# Altium schematic sheet P_A19_SmartPlugV3.SchDoc
size A2
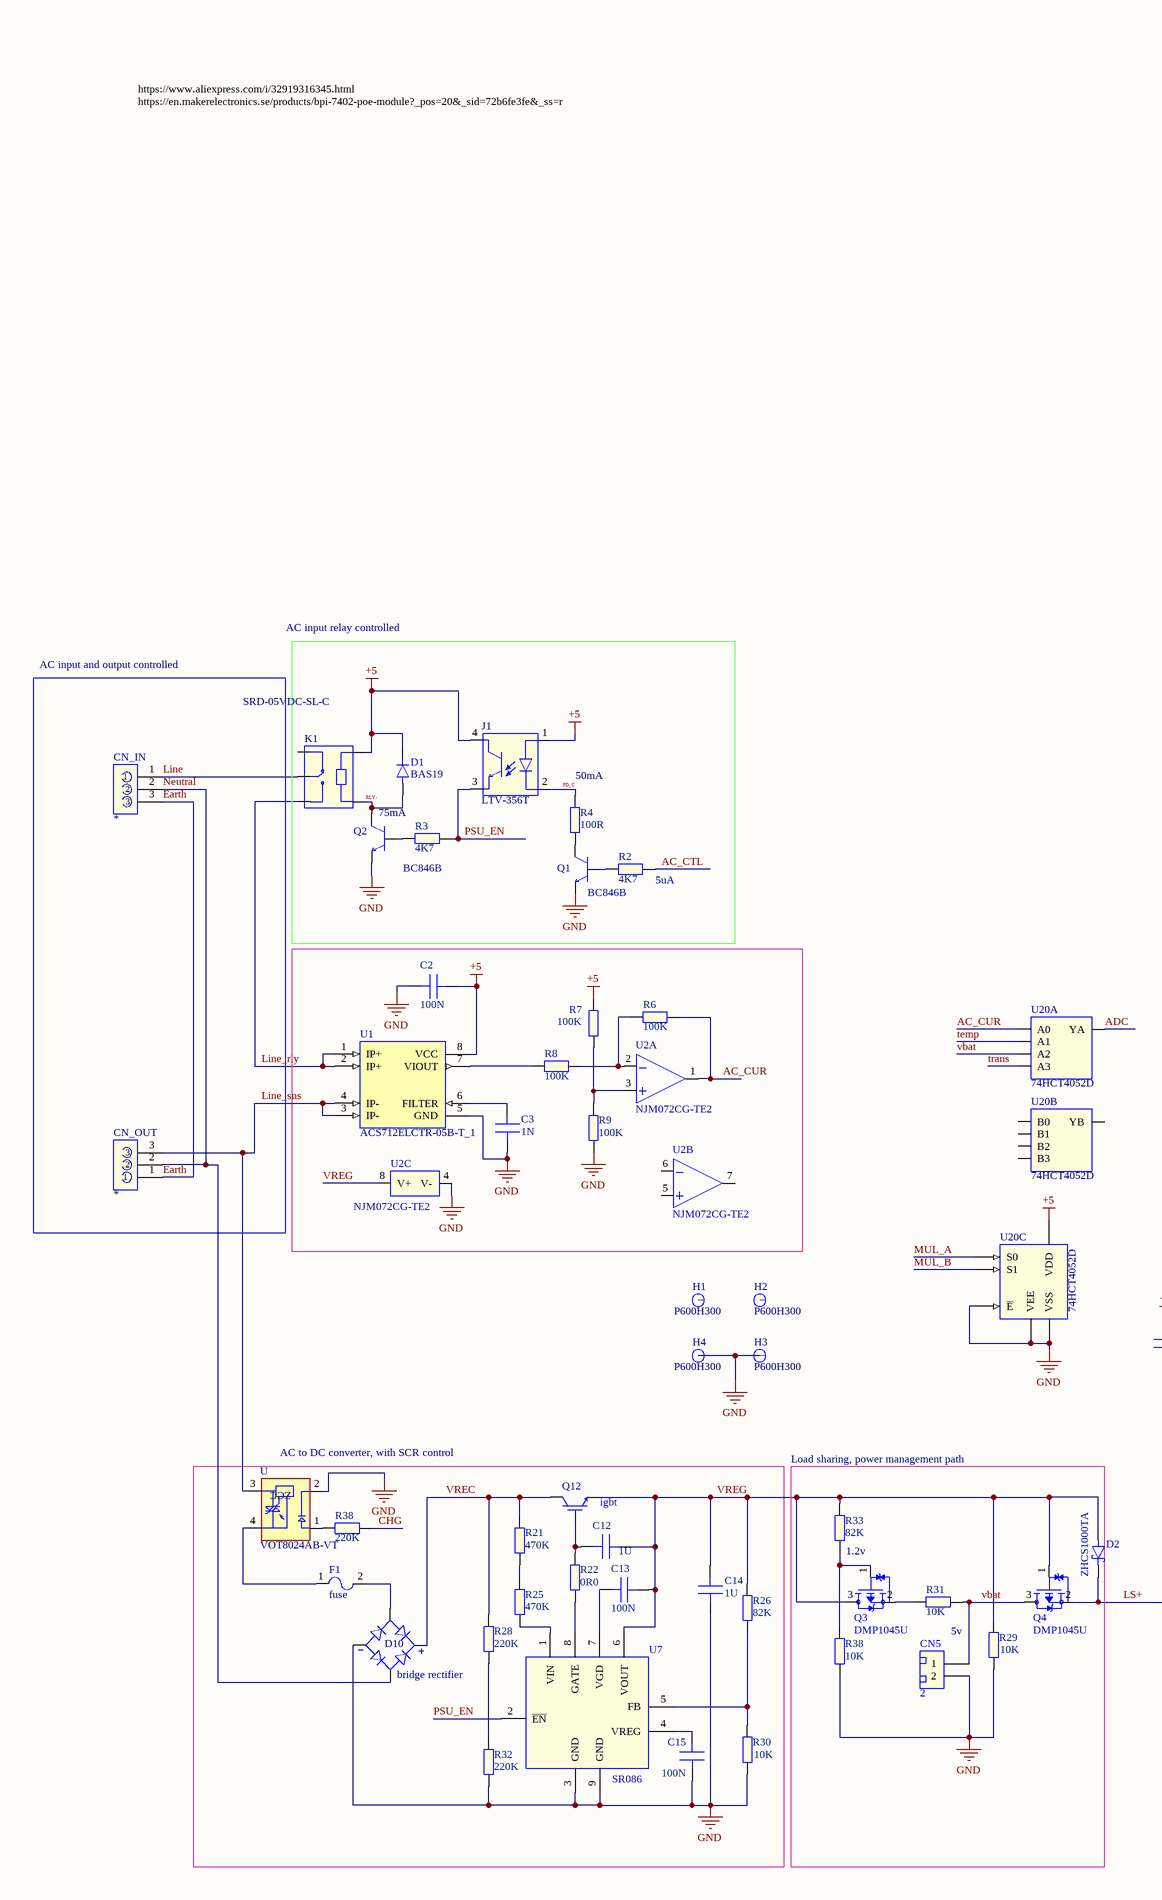
[diagram p0: P_A19_SmartPlugV3.SchDoc, left]
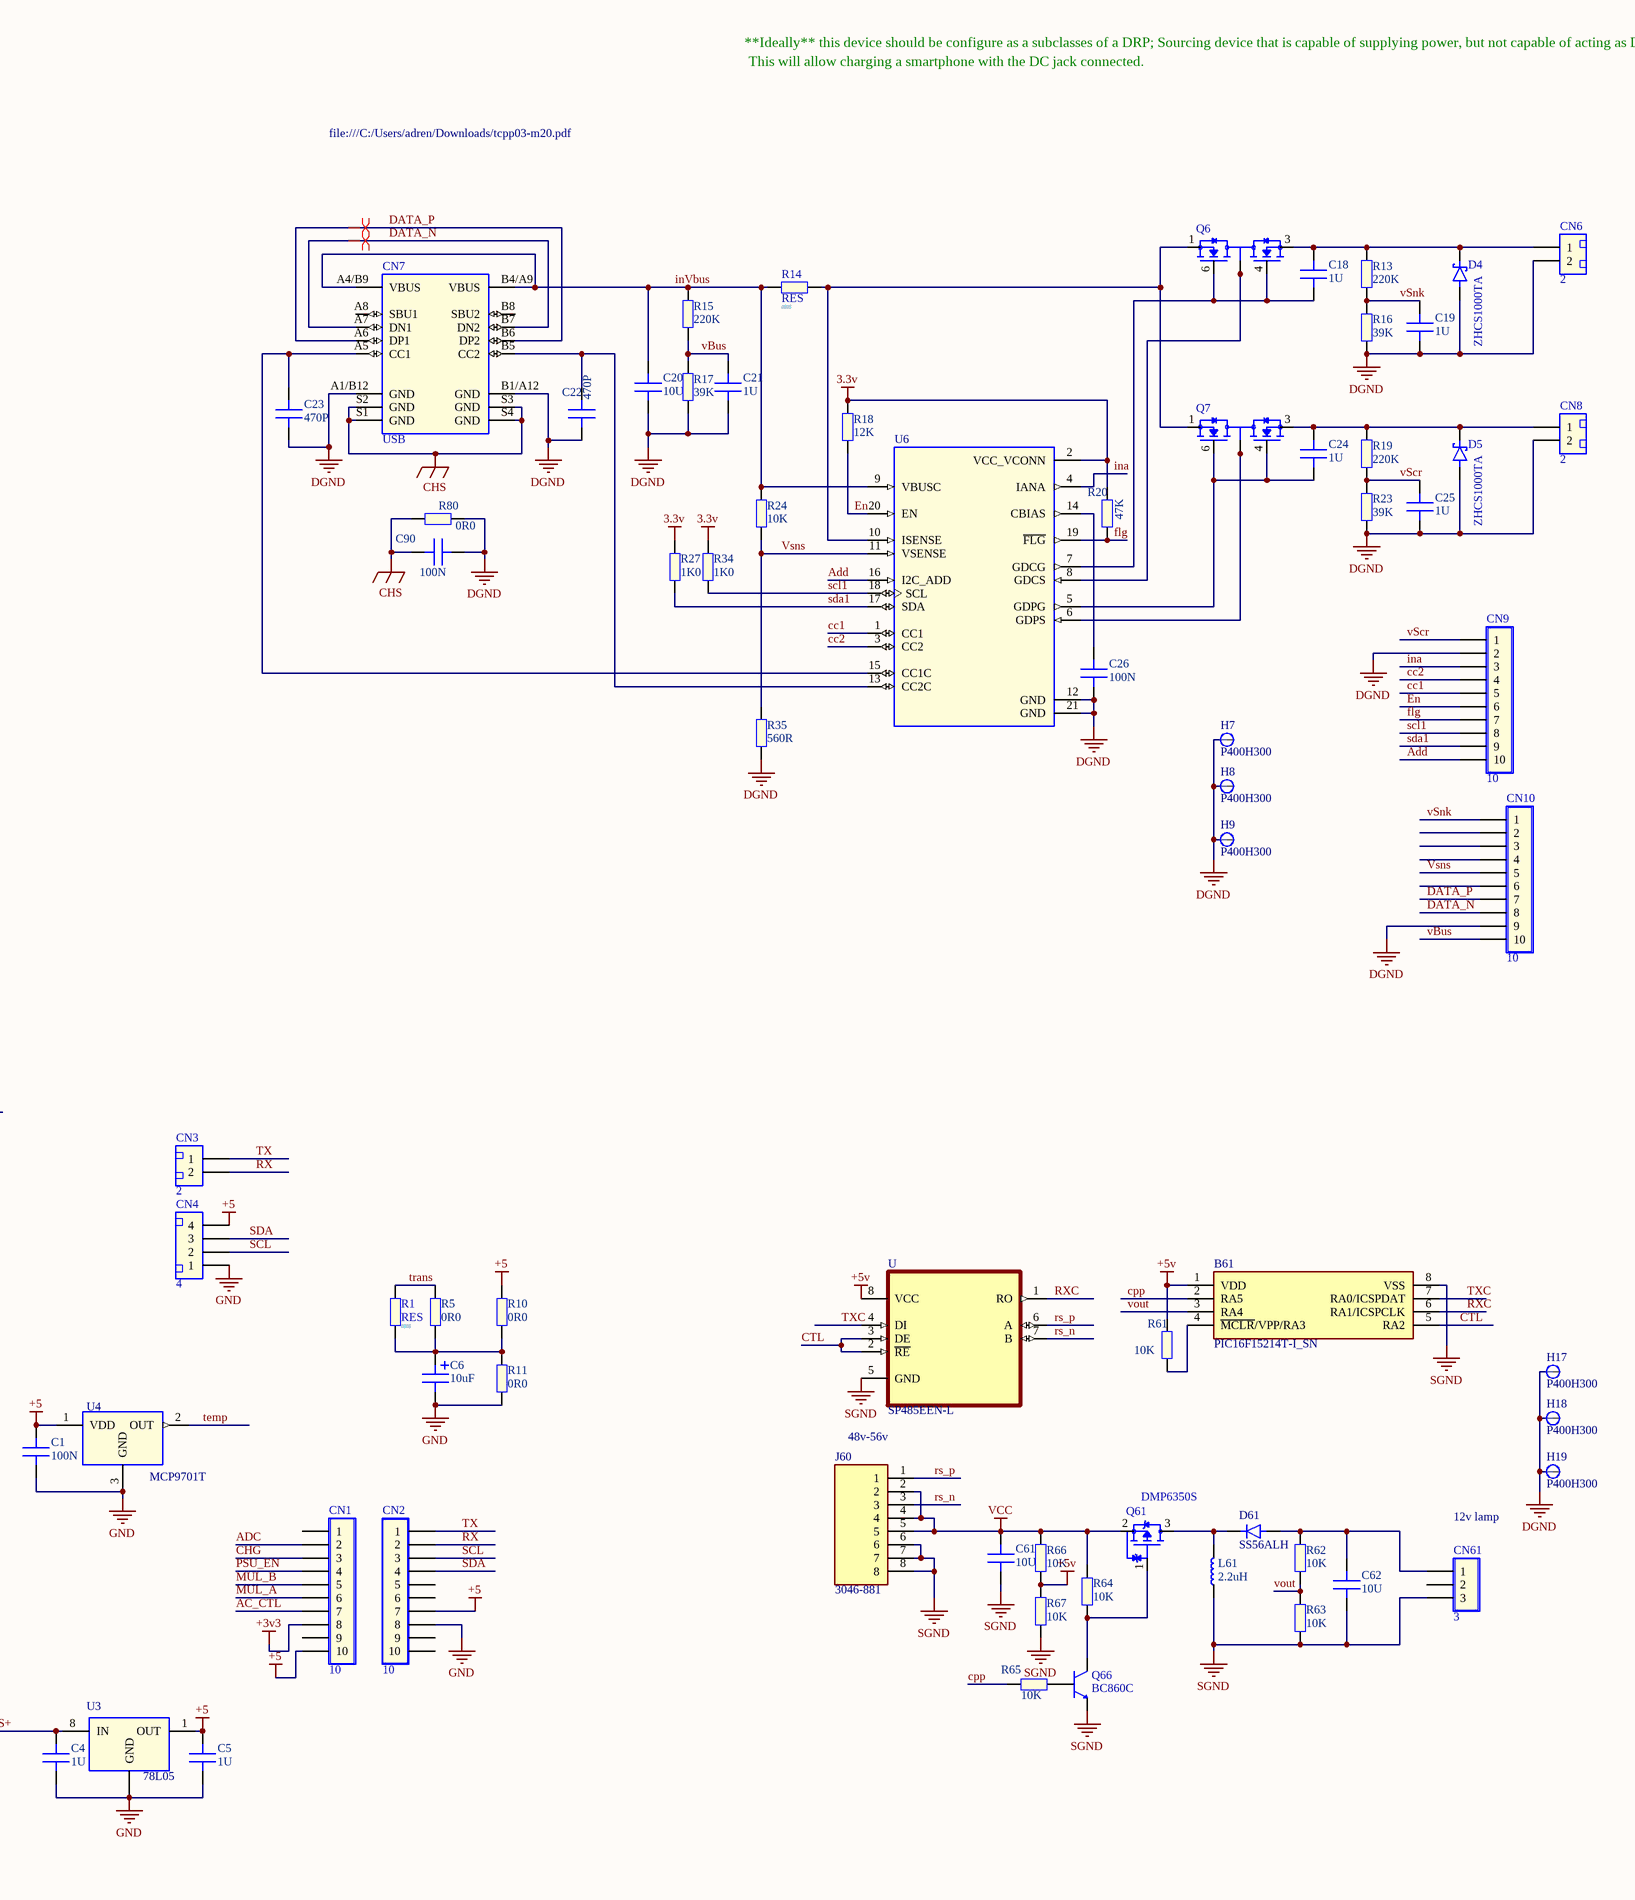
[diagram p1: P_A19_SmartPlugV3.SchDoc, right]

## Parts
(Parts that share a designator on the sheet are numbered #1, #2 ... from top to bottom, then left to right.)
B61  PIC16F15214T-I_SN  [SOIC127P600X175-8N]
C1  100N  [CAPC2012X60N]
C2  100N  [CAPC2012X60N]
C3  1N  [CAPC2012X60N]
C4  1U  [CAPC2012X60N]
C5  1U  [CAPC2012X60N]
C6  10uF  [CAPAE430X540]
C12  1U  [CAPC2012X60N]
C13  100N  [CAPC2012X60N]
C14  1U  [CAPC2012X60N]
C15  100N  [CAPC2012X60N]
C18  1U  [CAPC2012X60N]
C19  1U  [CAPC2012X60N]
C20  10U  [CAPC2012X60N]
C21  1U  [CAPC2012X60N]
C22  470P  [CAPC2012X60N]
C23  470P  [CAPC2012X60N]
C24  1U  [CAPC2012X60N]
C25  1U  [CAPC2012X60N]
C26  100N  [CAPC2012X60N]
C61  10U  [CAPC2012X60N]
C62  10U  [CAPC2012X60N]
C90  100N  [CAPC2012X60N]
CN1  10  [THT_Hdr_Fm_10x1_0.1_ST]
CN2  10  [THT_Hdr_Fm_10x1_0.1_ST]
CN3  2  [THT_Hdr_JST_XH_Fm_2x1_0.1_RA]
CN4  4  [THT_Hdr_JST_XH_Fm_4x1_0.1_RA]
CN5  2  [THT_Hdr_JST_XH_Fm_2x1_0.1_RA]
CN6  2  [THT_Hdr_JST_XH_Fm_2x1_0.1_RA]
CN7  USB  [GCT_USB4110-GF-A_REVB]
CN8  2  [THT_Hdr_JST_XH_Fm_2x1_0.1_RA]
CN9  10  [THT_Hdr_Fm_10x1_0.1_ST]
CN10  10  [THT_Hdr_Fm_10x1_0.1_ST]
CN61  3  [THT_Hdr_Fm_3x1_0.1_ST]
CN_IN  screwterminal  [TE_282841-3]  (value not drawn)
CN_OUT  screwterminal  [TE_282841-3]  (value not drawn)
D1  BAS19  [SOT95P230X110-3N]
D2  ZHCS1000TA  [SOT95P230X110-3N]
D4  ZHCS1000TA  [SOT95P230X110-3N]
D5  ZHCS1000TA  [SOT95P230X110-3N]
D10  bridge rectifier  [SOIC254P670X180-4N]
D61  SS56ALH  [SODFL5226X100N]
F1  fuse  [FUSC1608X60N]
H1  P600H300  [P600H300]
H2  P600H300  [P600H300]
H3  P600H300  [P600H300]
H4  P600H300  [P600H300]
H7  P400H300  [P400H300]
H8  P400H300  [P400H300]
H9  P400H300  [P400H300]
H17  P400H300  [P400H300]
H18  P400H300  [P400H300]
H19  P400H300  [P400H300]
J1  LTV-356T  [SOIC254P670X180-4N]
J60  3046-881  [VALCON_3046-881]
K1  SRD-05VDC-SL-C  [RELAY_SRD-05VDC-SL-C]  (mechanical)
L61  2.2uH  [INDC1811X91N]
Q1  BC846B  [SOT95P230X110_BEC-3N]
Q2  BC846B  [SOT95P230X110_BEC-3N]
Q3  DMP1045U  [SOT91P240X110-3N]
Q4  DMP1045U  [SOT91P240X110-3N]
Q6  (no value)  [SOT95P280X145-6N]
Q7  (no value)  [SOT95P280X145-6N]
Q12  igbt  [TO460P1010X230-3N]
Q61  DMP6350S  [SOT91P240X110-3N]
Q66  BC860C  [SOT95P230X110_BEC-3N]
R1  RES  Footprint: 0805  [RESADV350W55L740D260B]
R2  4K7  [RESC2012X60N]
R3  4K7  [RESC2012X60N]
R4  100R  [RESC2012X60N]
R5  0R0  [RESC2012X60N]
R6  100K  [RESC2012X60N]
R7  100K  [RESC2012X60N]
R8  100K  [RESC2012X60N]
R9  100K  [RESC2012X60N]
R10  0R0  [RESC2012X60N]
R11  0R0  [RESC2012X60N]
R13  220K  [RESC2012X60N]
R14  RES  Footprint: 0805  [RESADV350W55L740D260B]
R15  220K  [RESC2012X60N]
R16  39K  [RESC2012X60N]
R17  39K  [RESC2012X60N]
R18  12K  [RESC2012X60N]
R19  220K  [RESC2012X60N]
R20  47K  [RESC2012X60N]
R21  470K  [RESC2012X60N]
R22  0R0  [RESC2012X60N]
R23  39K  [RESC2012X60N]
R24  10K  [RESC2012X60N]
R25  470K  [RESC2012X60N]
R26  82K  [RESC2012X60N]
R27  1K0  [RESC2012X60N]
R28  220K  [RESC2012X60N]
R29  10K  [RESC2012X60N]
R30  10K  [RESC2012X60N]
R31  10K  [RESC2012X60N]
R32  220K  [RESC2012X60N]
R33  82K  [RESC2012X60N]
R34  1K0  [RESC2012X60N]
R35  560R  [RESC2012X60N]
R38#1  220K  [RESC2012X60N]
R38#2  10K  [RESC2012X60N]
R61  10K  [RESC2012X60N]
R62  10K  [RESC2012X60N]
R63  10K  [RESC2012X60N]
R64  10K  [RESC2012X60N]
R65  10K  [RESC2012X60N]
R66  10K  [RESC2012X60N]
R67  10K  [RESC2012X60N]
R80  0R0  [RESC2012X60N]
U1  ACS712ELCTR-05B-T_1  [SOIC127P600X175-8N]
U2  NJM072CG-TE2  [SOIC127P600X175-8N]  (parts A,B,C of 3)
U3  78L05  [SOIC127P600X175-8N]
U4  MCP9701T  [SOT95P230X110-3N]
U6  (no value)  [QFN50P400X400X80-21N]
U7  SR086  [SOIC127P600X175-9N]
U20  74HCT4052D  [SOIC127P600X175-16N]  (parts A,B,C of 3)
U#1  SP485EEN-L  [SOIC127P600X175-8N]
U#2  VOT8024AB-VT  [SOIC254P1016X440-4N]

## Blocks framed on the sheet
AC input and output controlled: CN_IN CN_OUT
AC to DC converter, with SCR control: C12-C15 D10 F1 Q12 R21 R22 R25 R26 R28 R30 R32 R38#1 U7 U#2

## Nets
3.3v: R18.2 R20.2 R27.2 R34.2 U6.2(VCC_VCONN)
+3v3: CN1.8
+5: C1.2 C2.2 C5.2 CN1.10 CN2.7 CN4.4 D1.3(K) J1.1(A) J1.4(COL) K1.A2 R7.2 R10.2 U1.8(VCC) U3.1(OUT) U4.1(VDD) U20.16(VDD)
+5v: B61.1(VDD) R61.2 R66.2 R67.1 U#1.8(VCC)
CHS: C90.1 CN7.S1(GND) CN7.S2(GND) CN7.S3(GND) CN7.S4(GND) R80.2
DGND: C19.1 C20.1 C21.1 C22.1 C23.1 C25.1 C26.1 C90.2 CN6.2 CN7.A1/B12(GND) CN7.B1/A12(GND) CN8.2 CN9.2 CN10.9 D4.3(A) D5.3(A) H7.1 H8.1 H9.1 H17.1 H18.1 H19.1 R16.1 R17.1 R23.1 R35.1 R80.1 U6.12(GND) U6.21(GND)
GND: C1.1 C2.1 C3.1 C4.1 C5.1 C6.2 C14.1 C15.1 CN2.8 CN4.1 CN5.2 D10.3(NEG) H3.1 H4.1 Q1.E Q2.E R9.2 R11.1 R29.1 R30.1 R32.1 R38#2.2 U1.5(GND) U2.4(V-) U3.2(GND) U3.3(GND) U3.6(GND) U3.7(GND) U4.3(GND) U7.3(GND) U7.9(GND) U20.6(~{E}) U20.7(VEE) U20.8(VSS) U#2.2(C)
SGND: B61.8(VSS) C61.1 C62.1 CN61.3 J60.6 J60.7 J60.8 L61.1 Q66.E R63.1 R67.2 U#1.5(GND)
VCC: C61.2 J60.2 J60.4 J60.5 Q61.2(S) R64.2 R66.1
AC_CTL: CN1.7 R2.2
AC_CUR: R6.1 U2.1(OUTPUT) U20.12(A0)
ADC: CN1.2 U20.13(YA)
Add: CN9.10 U6.16(I2C_ADD)
cc1: CN9.5 U6.1(CC1)
cc2: CN9.4 U6.3(CC2)
CHG: CN1.3 R38#1.1
cpp: B61.2(RA5) R65.2
CTL: B61.5(RA2) U#1.2(~{RE}) U#1.3(DE)
DATA_N: CN7.A7(DN1) CN7.B7(DN2) CN10.8
DATA_P: CN7.A6(DP1) CN7.B6(DP2) CN10.7
Earth: CN_IN.3 CN_OUT.1
En: CN9.6 R18.1 U6.20(EN)
flg: CN9.7 R20.1 U6.19(~{FLG})
ina: CN9.3 U6.4(IANA)
inVbus: C20.2 CN7.A4/B9(VBUS) CN7.B4/A9(VBUS) R14.1 R15.2 R24.2 U6.9(VBUSC)
Line: CN_IN.1 K1.COM
Line_rly: K1.NO U1.1(IP+) U1.2(IP+)
Line_sns: CN_OUT.3 U1.3(IP-) U1.4(IP-) U#2.3(MT1)
LS+: C4.2 D2.1(K) Q4.2(S) U3.8(IN)
MUL_A: CN1.6 U20.10(S0)
MUL_B: CN1.5 U20.9(S1)
Neutral: CN_IN.2 CN_OUT.2 D10.2(AC1)
PD_C: J1.2(C) R4.2
PSU_EN: CN1.4 J1.3(EMIT) R3.2 U7.2(~{EN})
RLY-: D1.1(A) K1.A1 Q2.C
rs_n: J60.3 U#1.7(B)
rs_p: J60.1 U#1.6(A)
RX: CN2.2 CN3.2
RXC: B61.6(RA1/ICSPCLK) U#1.1(RO)
SCL: CN2.3 CN4.2
scl1: CN9.8 R34.1 U6.18(SCL)
SDA: CN2.4 CN4.3
sda1: CN9.9 R27.1 U6.17(SDA)
temp: U4.2(OUT) U20.14(A1)
trans: R1.2 R5.2 U20.11(A3)
TX: CN2.1 CN3.1
TXC: B61.7(RA0/ICSPDAT) U#1.4(DI)
vbat: CN5.1 Q4.3(D) R31.1 U20.15(A2)
vBus: C21.2 CN10.10 R15.1 R17.2
vout: B61.3(RA4) R62.1 R63.2
VREC: D10.1(POS) Q12.2(C) R21.2 R28.2
VREG: C12.2 C13.2 C14.2 D2.3(A) Q3.3(D) Q4.1(G) Q12.3(E) R26.2 R29.2 R33.2 U2.8(V+) U7.6(VOUT)
vScr: C25.2 CN9.1 R19.1 R23.2
vSnk: C19.2 CN10.1 R13.1 R16.2
Vsns: CN10.5 R24.1 R35.2 U6.11(VSENSE)
NetB61_4: B61.4(~{MCLR}/VPP/RA3) R61.1
NetC3_2: C3.2 U1.6(FILTER)
NetC6_1: C6.1 R1.1 R5.1 R10.1 R11.2
NetC12_1: C12.1 Q12.1(G) R22.2
NetC13_1: C13.1 U7.7(VGD)
NetC15_2: C15.2 U7.4(VREG)
NetC18_1: C18.1 Q6.4(G2) Q6.6(G1) U6.7(GDCG)
NetC18_2: C18.2 CN6.1 D4.1(K) Q6.3(S2) R13.2
NetC22_2: C22.2 CN7.B5(CC2) U6.13(CC2C)
NetC23_2: C23.2 CN7.A5(CC1) U6.15(CC1C)
NetC24_1: C24.1 Q7.4(G2) Q7.6(G1) U6.5(GDPG)
NetC24_2: C24.2 CN8.1 D5.1(K) Q7.3(S2) R19.2
NetC26_2: C26.2 U6.14(CBIAS)
NetC62_2: C62.2 CN61.1 D61.2(A) R62.2
NetD10_4: D10.4(AC2) F1.2
NetD61_1: D61.1(K) L61.2 Q61.3(D)
NetF1_1: F1.1 U#2.4(MT2)
NetQ1_B: Q1.B R2.1
NetQ1_C: Q1.C R4.1
NetQ2_B: Q2.B R3.1
NetQ3_1: Q3.1(G) R33.1 R38#2.1
NetQ3_2: Q3.2(S) R31.2
NetQ6_1: Q6.1(S1) Q7.1(S1) R14.2 U6.10(ISENSE)
NetQ6_2: Q6.2(D12) Q6.5(D12) U6.8(GDCS)
NetQ7_2: Q7.2(D12) Q7.5(D12) U6.6(GDPS)
NetQ61_1: Q61.1(G) Q66.C R64.1
NetQ66_B: Q66.B R65.1
NetR6_2: R6.2 R8.1 U2.2(INV)
NetR7_1: R7.1 R9.1 U2.3(NONINV)
NetR8_2: R8.2 U1.7(VIOUT)
NetR21_1: R21.1 R25.2
NetR22_1: R22.1 U7.8(GATE)
NetR25_1: R25.1 U7.1(VIN)
NetR26_1: R26.1 R30.2 U7.5(FB)
NetR28_1: R28.1 R32.2
NetR38#1_2: R38#1.2 U#2.1(A)

Not connected (* = marked no-connect by the designer): CN1 1 9; CN2 5 6 9 10; CN7 A8(SBU1) B8(SBU2); CN10 2 3 4 6; CN61 2; H1 1; H2 1; K1 NC; U2 5(NONINV) 6(INV) 7(OUTPUT); U20 1(B0) 2(B2) 3(YB) 4(B3) 5(B1)

## Layout directives
differential pair: DATA_N, DATA_P

## Notes on the sheet
- **Ideally** this device should be configure as a subclasses of a DRP; Sourcing device that is capable of supplying power, but not capable of acting as DFP
- This will allow charging a smartphone with the DC jack connected.
- file:///C:/Users/adren/Downloads/tcpp03-m20.pdf
- https://www.aliexpress.com/i/32919316345.html
  https://en.makerelectronics.se/products/bpi-7402-poe-module?_pos=20&_sid=72b6fe3fe&_ss=r
- AC input relay controlled
- 50mA
- (near Q2) 75mA
- (near R2) 5uA
- 48v-56v
- Load sharing, power management path
- 12v lamp
- (near R33) 1.2v
- 5v
- (in symbol VOT8024AB-VT) ZCC

## Library data of the parts
B61 = PIC16F15214T-I_SN: PIC16F15214T-I/SN; Manufacturer_Name: Microchip; Geometry.Height: 1.75mm; Manufacturer_Part_Number: PIC16F15214T-I/SN; Mouser Part Number: 579-PIC16F15214TI/SN; Mouser Price/Stock: https://www.mouser.co.uk/ProductDetail/Microchip-Technology/PIC16F15214T-I-SN?qs=xZ%2FP%252Ba9zWqa0z7iit6vIGQ%3D%3D; Arrow Part Number: PIC16F15214T-I/SN; Arrow Price/Stock: https://www.arrow.com/en/products/pic16f15214t-isn/microchip-technology?region=nac; Datasheet Link: https://ww1.microchip.com/downloads/en/DeviceDoc/PIC16F15213-14-23-24-43-44-Data-Sheet-DS40002195B.pdf
C1 C2 C26 C90 = 118: 100N 0805 X7R 5% 50V SMD Ceramic capacitor; UA P/N: 16-0001; LibraryVersion: v1; Value: 100N; Farnell: 2408561; My_PN: *; Mounting: SMT; Unique ID: 118; Cost: 0.0195; Category: [0000] Passive components; Subcategory: [0002] Capacitor
C3 = 122: 1N 0805 COG 100V SMD Ceramic capacitor; UA P/N: 16-0008; LibraryVersion: v1; Value: 1N; Farnell: 718567RL; My_PN: *; Mounting: SMT; Unique ID: 122; Cost: 0.0123; Category: [0000] Passive components; Subcategory: [0002] Capacitor
C4 C5 C12 C14 C18 C19 C21 C24 C25 = 138: 1U 0805 50V X7R SMD Ceramic capacitor; UA P/N: 16-0010; LibraryVersion: v1; Value: 1U; Farnell: 3366605; My_PN: *; Mounting: SMT; Unique ID: 138; Cost: 0.0199; Category: [0000] Passive components; Subcategory: [0002] Capacitor
C6 = 141: 10uF 16V Multicomp SMD Electrolytic; UA P/N: 16-0026; LibraryVersion: v1; Value: 10uF; Farnell: 9265686; My_PN: *; Mounting: SMT; Unique ID: 141; Cost: 0.0533; Category: [0000] Passive components; Subcategory: [0003] Capacitor electrolytic
C13 C15 = 135: 100N 1206 COG 50V SMD Ceramic capacitor; UA P/N: 16-0021; LibraryVersion: v1; Value: 100N; Farnell: 2211074RL; My_PN: *; Mounting: SMT; Unique ID: 135; Cost: 0.122; Category: [0000] Passive components; Subcategory: [0002] Capacitor
C20 = 139: 10U 0805  X6S 35V SMD Ceramic capacitor; UA P/N: 16-0004; LibraryVersion: v1; Value: 10U; Farnell: 3581774; My_PN: *; Mounting: SMT; Unique ID: 139; Cost: 0.172; Category: [0000] Passive components; Subcategory: [0002] Capacitor
C22 C23 = 119: 470P 0805 X7R 10% 50V Ceramic Capacitor; UA P/N: 16-0018; LibraryVersion: v1; Value: 470P; Farnell: 1759216; My_PN: *; Mounting: SMT; Unique ID: 119; Cost: 0.0108; Category: [0000] Passive components; Subcategory: [0002] Capacitor
C61 C62 = 166: 10U 0805  X5R 25V SMD Ceramic capacitor; UA P/N: 16-0049; LibraryVersion: v1; Value: 10U; Farnell: 3366590; My_PN: *; Mounting: SMT; Unique ID: 166; Cost: 0.172; Category: [0000] Passive components; Subcategory: [0002] Capacitor
CN1 CN2 CN9 CN10 = 377: 10 WAY FM SOCKET; UA P/N: 112-0102; LibraryVersion: V1; Farnell: V06-1x10-SV-GF-1; ComponentLink1Description: Web MF; ComponentLink1URL: https://www.jst.co.uk/; ComponentLink2Description: Datasheet web; ComponentLink2URL: https://www.jst-mfg.com; ComponentLink3Description: Datasheet local; ComponentLink3URL: /D/; Value: 10; Unique ID: 377; Cost: 0.0712; Category: [0500] Connectors; Subcategory: [0503] Headers; Mounting: THT
CN3 CN5 CN6 CN8 = 535: 2 PIN SIL JST 2.54mm straight angle; LibraryVersion: V1; ComponentLink1Description: Web MF; ComponentLink1URL: https://www.jst.co.uk/; ComponentLink2Description: Datasheet web; ComponentLink2URL: https://www.jst-mfg.com; ComponentLink3Description: Datasheet local; ComponentLink3URL: /D/; Value: 2; Unique ID: 535; Cost: 0; Category: [0500] Connectors; Subcategory: [0507] Header JST XH; Mounting: THT
CN4 = 533: 4 PIN SIL JST 2.54mm straight angle; LibraryVersion: V1; ComponentLink1Description: Web MF; ComponentLink1URL: https://www.jst.co.uk/; ComponentLink2Description: Datasheet web; ComponentLink2URL: https://www.jst-mfg.com; ComponentLink3Description: Datasheet local; ComponentLink3URL: /D/; Value: 4; Unique ID: 533; Cost: 0; Category: [0500] Connectors; Subcategory: [0507] Header JST XH; Mounting: THT
CN7 = 399: USB C CONNECTOR SMD; UA P/N: 112-0099; LibraryVersion: V1; Farnell: 3588206; Value: USB; ComponentLink1Description: Web MF; ComponentLink1URL: https://gct.co; ComponentLink2Description: Datasheet web; ComponentLink2URL: https://pdf1.alldatasheet.com/datasheet-pdf/view/1355856/ETC/USB4110-GF-A.html; ComponentLink3Description: Datasheet local; ComponentLink3URL: /D/; Unique ID: 399; Cost: 0.662; Category: [0500] Connectors; Subcategory: [0502] USB connectors; Mounting: SMD
CN61 = 536: 3 PIN SIL 0.1"; LibraryVersion: V1; ComponentLink1Description: Web MF; ComponentLink1URL: https://www.jst.co.uk/; ComponentLink2Description: Datasheet web; ComponentLink2URL: https://www.jst-mfg.com; ComponentLink3Description: Datasheet local; ComponentLink3URL: /D/; Value: 3; Unique ID: 536; Cost: 0; Category: [0500] Connectors; Subcategory: [0503] Headers; Mounting: THT
CN_IN CN_OUT = 523: LibraryVersion: V1; Price: None; Check_prices: https://www.snapeda.com/parts/282841-3/TE+Connectivity+AMP+Connectors/view-part/?ref=eda; Value: screwterminal; SnapEDA_Link: https://www.snapeda.com/parts/282841-3/TE+Connectivity+AMP+Connectors/view-part/?ref=snap; EU_RoHS_Compliance: Compliant with Exemptions; Availability: In Stock; Purchase-URL: https://pricing.snapeda.com/search?q=282841-3&ref=eda; Comment_1: *; Unique ID: 523; Cost: 0; Category: [0500] Connectors; Subcategory: [0509] ScrewTerminal; Mounting: THT
D1 = 214: BAS19 SMD Signal Diode Alternative 15-0007; UA P/N: 15-0081; LibraryVersion: v1; Farnell: 2319273; Value: BAS19; ComponentLink1Description: Web MF; ComponentLink1URL: https://www.nexperia.com; ComponentLink2Description: Datasheet web; ComponentLink2URL: https://www.nexperia.com/products/diodes/automotive-diodes/automotive-switching-diodes/automotive-general-purpose-switching-diodes/BAS19.html; ComponentLink3Description: Datasheet local; ComponentLink3URL: /D/; Unique ID: 214; Cost: 0.0116; Category: [0300] Discrete Semiconductors; Subcategory: [0304] Diodes; Mounting: SMT
D2 D4 D5 = 219: ZHCS1000TA Schottky Rectifier, 40V 1A 425 mV; UA P/N: 15-0119; LibraryVersion: v1; Farnell: 9526773; Value: ZHCS1000TA; ComponentLink1Description: Web MF; ComponentLink1URL: https://www.diodes.com; ComponentLink2Description: Datasheet web; ComponentLink2URL: https://pdf1.alldatasheet.com/datasheet-pdf/view/515456/DIODES/ZHCS1000TA.html; ComponentLink3Description: Datasheet local; ComponentLink3URL: /D/; Unique ID: 219; Cost: 0.157; Category: [0300] Discrete Semiconductors; Subcategory: [0308] Schottky Diodes; Mounting: SMT
D10 = 521: LibraryVersion: V1; Check_prices: https://www.snapeda.com/parts/MB10F-13/Diodes+Inc./view-part/?ref=eda; Value: bridge rectifier; Availability: In Stock; Price: None; SnapEDA_Link: https://www.snapeda.com/parts/MB10F-13/Diodes+Inc./view-part/?ref=snap; Purchase-URL: https://pricing.snapeda.com/search/part/MB10F-13/?ref=eda; Unique ID: 521; Cost: 0; Category: [0300] Discrete Semiconductors; Subcategory: [0306}BridgeRectifiers; Mounting: SMT
D61 = SS56ALH: 5A, 60V, Schottky Rectifier; MF: Taiwan Semiconductor; Package: DO-221AC Taiwan Semiconductor; Availability: In Stock; Value: *; MP: SS56ALH; Check_prices: https://www.snapeda.com/parts/SS56ALH/Taiwan+Semiconductor/view-part/?ref=eda; Price: None; SnapEDA_Link: https://www.snapeda.com/parts/SS56ALH/Taiwan+Semiconductor/view-part/?ref=snap
F1 = 524: LibraryVersion: V1; Mouser-Purchase-URL: https://snapeda.com/shop?store=Mouser&id=4616119; SnapEDA_Link: https://www.snapeda.com/parts/0686F1000-01/Bel%20Fuse/view-part/4616119/?ref=snap; Price: None; Availability: Unavailable; Value: fuse; Unique ID: 524; Cost: 0; Category: [0700] Circuit Protection; Subcategory: [0702]Fuse; Mounting: SMT
H1-H4 = 505: [1001]HOLE_PLATED_P600H300; Value: P600H300; Unique ID: 505; Category: [1000] Machining; Subcategory: [1001] Holes
H7-H9 H17-H19 = 506: [1001]HOLE_PLATED_P400H300; Value: P400H300; Unique ID: 506; Category: [1000] Machining; Subcategory: [1001] Holes
J1 = 531: LibraryVersion: V1; Value: LTV-356T; Check_prices: https://www.snapeda.com/parts/LTV-356T/Lite-On+Inc./view-part/?ref=eda; SnapEDA_Link: https://www.snapeda.com/parts/LTV-356T/Lite-On+Inc./view-part/?ref=snap; Availability: In Stock; Purchase-URL: https://pricing.snapeda.com/search/part/LTV-356T/?ref=eda; Price: None; Unique ID: 531; Cost: 0; Category: [0400] Optoelectronics; Subcategory: [0402]Optocouplers; Mounting: SMT
J60 = 3046-881: Value: C708627; Price: None; Availability: Unavailable; MP: 3046-881; Package: None
K1 = RELAY_SPDT_TEMPLATE: 5V Trigger Relay Module For Arduino And Raspberry Pi 5V Trigger Relay Module For Arduino And Raspberry Pi; MF: Songle Relay; Check_prices: https://www.snapeda.com/parts/SRD-05VDC-SL-C/Songle+Relay/view-part/?ref=eda; Value: SRD-05VDC-SL-C; Availability: Not in stock; Price: None; Package: NON STANDARD-5 Songle Relay; MP: SRD-05VDC-SL-C; SnapEDA_Link: https://www.snapeda.com/parts/SRD-05VDC-SL-C/Songle+Relay/view-part/?ref=snap; LCSC: C140615
L61 = 503: 2.2uH inductor; UA P/N: 113-0031; LibraryVersion: V1; Value: 2.2uH; Farnell: 2288737; My_PN: *; Mounting: SMT; Unique ID: 503; Cost: 0.422; Category: [0000] Passive components; Subcategory: [0005] Inductor
Q1 Q2 = 268: BC846B NPN General Purpose Transistor; UA P/N: 15-0008; LibraryVersion: v1; Farnell: 2319373; Value: BC846B; ComponentLink1Description: Web MF; ComponentLink1URL: https://www.nexperia.com; ComponentLink2Description: Datasheet web; ComponentLink2URL: https://pdf1.alldatasheet.com/datasheet-pdf/view/1577659/NEXPERIA/BC846A.html; ComponentLink3Description: Datasheet local; ComponentLink3URL: /D/; Unique ID: 268; Cost: 0.02652; Category: [0300] Discrete Semiconductors; Subcategory: [0301] BJTs; Mounting: SMT
Q3 Q4 = DMP1045U: P-Channel 12V 4A (Ta) 800mW (Ta) Surface Mount SOT-23; MP: FS8205A; UA P/N: 15-0xxx; Farnell: *; Mouser: *; RS: *; DigiKey: *; Arrow: *; Profusion: *; My_P/N: *; HelpURL: https://www.diodes.com/assets/Datasheets/DMP1045U.pdf; Package: SOT91P240X110-3N; Value: DMP1045U; ComponentLink1Description: Web MF; ComponentLink1URL: https://www.diodes.com; ComponentLink2Description: Datasheet web; ComponentLink2URL: https://html.alldatasheet.com/html-pdf/833068/DIODES/DMP1045U/217/1/DMP1045U.html; ComponentLink3Description: Datasheet local; ComponentLink3URL: /D/
Q6 Q7 = 529: MOSFET; LibraryVersion: V1; ComponentLink1Description: Web MF; ComponentLink1URL: http://forsemi.com; ComponentLink2Description: Datasheet web; ComponentLink2URL: https://pdf1.alldatasheet.com/datasheet-pdf/view/1132762/FORTUNE/FS8205A.html; ComponentLink3Description: Datasheet local; ComponentLink3URL: /D/; Mounting: SMT; Unique ID: 529; Cost: 0; Category: [0300] Discrete Semiconductors; Subcategory: [0303] MOSFETs
Q12 = 520: LibraryVersion: V1; Value: igbt; ComponentLink1Description: Web MF; ComponentLink1URL: https://www.nexperia.com; ComponentLink2Description: Datasheet web; ComponentLink2URL: https://pdf1.alldatasheet.com/datasheet-pdf/view/1577659/NEXPERIA/BC846A.html; ComponentLink3Description: Datasheet local; ComponentLink3URL: /D/; Unique ID: 520; Cost: 0; Category: [0300] Discrete Semiconductors; Subcategory: [0305] IGBT; Mounting: SMT
Q61 = MOSFET_TEMPLATE: P-Channel 12V 4A (Ta) 800mW (Ta) Surface Mount SOT-23; MP: FS8205A; UA P/N: 15-0xxx; Farnell: *; Mouser: *; RS: *; DigiKey: *; Arrow: *; Profusion: *; My_P/N: *; HelpURL: https://www.diodes.com/assets/Datasheets/DMP1045U.pdf; Package: SOT91P240X110-3N; Value: DMP6350S; ComponentLink1Description: Web MF; ComponentLink1URL: https://www.diodes.com; ComponentLink2Description: Datasheet web; ComponentLink2URL: https://html.alldatasheet.com/html-pdf/833068/DIODES/DMP1045U/217/1/DMP1045U.html; ComponentLink3Description: Datasheet local; ComponentLink3URL: /D/
Q66 = 271: BC860C Low Noise PNP 45V Transistor; UA P/N: 15-0012; LibraryVersion: v1; Farnell: 771-BC850C-T/R; Value: BC860C; ComponentLink1Description: Web MF; ComponentLink1URL: https://www.nexperia.com; ComponentLink2Description: Datasheet web; ComponentLink2URL: https://pdf1.alldatasheet.com/datasheet-pdf/view/1577659/NEXPERIA/BC846A.html; ComponentLink3Description: Datasheet local; ComponentLink3URL: /D/; Unique ID: 271; Cost: 0.03664; Category: [0300] Discrete Semiconductors; Subcategory: [0301] BJTs; Mounting: SMT
R1 R14 = 526: UA P/N: 13-1004; LibraryVersion: v1; Value: RES; Parameter 14: *; Mounting: THT; ComponentLink1Description: Web MF; ComponentLink1URL: /D/; ComponentLink2Description: Datasheet web; ComponentLink2URL: /D/; ComponentLink3Description: Datasheet local; ComponentLink3URL: /D/; Unique ID: 526; Cost: 0; Category: [0000] Passive components; Subcategory: [0011] Resistor Through Hole
R2 R3 = 59: 4K7 0805 Thick Film 1% Resistor; UA P/N: 13-0060; LibraryVersion: v1; Value: 4K7; Farnell: 2446989; My_PN: *; Mounting: SMT; Unique ID: 59; Cost: 0.00172; Category: [0000] Passive components; Subcategory: [0001] Resistor
R4 = 3: 100R 0805Thick Film 1% resistor; UA P/N: 13-0004; LibraryVersion: v1; Value: 100R; Farnell: 2446869; My_PN: *; Mounting: SMT; Unique ID: 3; Cost: 0.00218; Category: [0000] Passive components; Subcategory: [0001] Resistor
R5 R10 R11 R22 R80 = 0: 0R0 0805Thick Film 1% Resistor; UA P/N: 13-0001; LibraryVersion: v1; Value: 0R0; Farnell: 2692652; My_PN: *; Mounting: SMT; Unique ID: 0; Cost: 0.0049; Category: [0000] Passive components; Subcategory: [0001] Resistor
R6-R9 = 1: 100K 0805Thick Film 1% resistor; UA P/N: 13-0002; LibraryVersion: v1; Value: 100K; Farnell: 2446868; My_PN: *; Mounting: SMT; Unique ID: 1; Cost: 0.0016; Category: [0000] Passive components; Subcategory: [0001] Resistor
R13 R15 R19 R28 R32 R38#1 = 29: 220K 0805 Thick Film 1% resistor; UA P/N: 13-0030; LibraryVersion: v1; Value: 220K; Farnell: 2129302; My_PN: *; Mounting: SMT; Unique ID: 29; Cost: 0.00254; Category: [0000] Passive components; Subcategory: [0001] Resistor
R16 R17 R23 = 46: 39K 0805 Thick Film 1% Resistor; UA P/N: 13-0047; LibraryVersion: v1; Value: 39K; Farnell: 1500670; My_PN: *; Mounting: SMT; Unique ID: 46; Cost: 0.0211; Category: [0000] Passive components; Subcategory: [0001] Resistor
R18 = 13: 12K 0805 Thick Film 1% Resistor; UA P/N: 13-0014; LibraryVersion: v1; Value: 12K; Farnell: 2129199; My_PN: *; Mounting: SMT; Unique ID: 13; Cost: 0.0024; Category: [0000] Passive components; Subcategory: [0001] Resistor
R20 = 57: 47K 0805 Thick Film 1% Resistor; UA P/N: 13-0058; LibraryVersion: v1; Value: 47K; Farnell: 2446981; My_PN: *; Mounting: SMT; Unique ID: 57; Cost: 0.00311; Category: [0000] Passive components; Subcategory: [0001] Resistor
R21 R25 = 54: 470K 0805 THICK FILM 1% Resistor; UA P/N: 13-0055; LibraryVersion: v1; Value: 470K; Farnell: 2446978; My_PN: *; Mounting: SMT; Unique ID: 54; Cost: 0.00472; Category: [0000] Passive components; Subcategory: [0001] Resistor
R24 R29-R31 R38#2 R61-R67 = 6: 10K 0805Thick Film 1% Resistor; UA P/N: 13-0007; LibraryVersion: v1; Value: 10K; Farnell: 2446870; My_PN: *; Mounting: SMT; Unique ID: 6; Cost: 0.0014; Category: [0000] Passive components; Subcategory: [0001] Resistor
R26 = 74: 82K TF 0805 Thin Film 1% Resistor; UA P/N: 13-0075; LibraryVersion: v1; Value: 82K; Farnell: 1500670; My_PN: *; Mounting: SMT; Unique ID: 74; Cost: 0.0211; Category: [0000] Passive components; Subcategory: [0001] Resistor
R27 R34 = 21: 1K0 0805 Thick Film 1% Resistor; UA P/N: 13-0022; LibraryVersion: v1; Value: 1K0; Farnell: 2446904; My_PN: *; Mounting: SMT; Unique ID: 21; Cost: 0.00214; Category: [0000] Passive components; Subcategory: [0001] Resistor
R33 = 73: 82K 0805 Thick Film 1% Resistor; UA P/N: 13-0074; LibraryVersion: v1; Value: 82K; Farnell: 2447046; My_PN: *; Mounting: SMT; Unique ID: 73; Cost: 0.00272; Category: [0000] Passive components; Subcategory: [0001] Resistor
R35 = 61: 560R 0805 Thick Film 1% Resistor; UA P/N: 13-0062; LibraryVersion: v1; Value: 560R; Farnell: 2447003; My_PN: *; Mounting: SMT; Unique ID: 61; Cost: 0.0034; Category: [0000] Passive components; Subcategory: [0001] Resistor
U1 = ACS712ELCTR-05B-T_1: Current Sensor 5A 1 Channel Hall Effect, Open Loop Bidirectional 8-SOIC (0.154, 3.90mm Width); MF: Allegro; SnapEDA_Link: https://www.snapeda.com/parts/ACS712ELCTR-05B-T/Allegro%20Industries/view-part/330078/?ref=snap; Availability: In Stock; Check_prices: https://www.snapeda.com/parts/ACS712ELCTR-05B-T/Allegro%20Industries/view-part/330078/?ref=eda; Value: *; Package: SOIC-8 Allegro MicroSystems LLC; MP: ACS712ELCTR-05B-T; Price: None; LCSC: C44471
U2 = 221: NJM072CG-TE2 IC GP DUAL OPERATIONAL AMPLIFIER; UA P/N: 15-0037; LibraryVersion: v1; Value: NJM072CG-TE2; Parameter 14: *; Unique ID: 221; Cost: 0.04672; Category: [0100] Integrated circuits; Subcategory: [0101] Amplifiers; Mounting: SMT
U3 = 253: 78L05 SMD SO8 5V 100mA Regulator; UA P/N: 15-0004; LibraryVersion: v1; Unique ID: 253; Value: 78L05; Cost: 0.10534; Farnell: 2296018RL/2318505/3122771; Category: [0100] Integrated circuits; Subcategory: [0102] Voltage Regulator - Linear; Mounting: SMT
U4 = 179: MCP9701T Temerature sensor IC SMD; UA P/N: 15-0032; LibraryVersion: v1; Unique ID: 179; Value: MCP9701T; Cost: 0.175; Farnell: 1834865; Category: [0100] Integrated circuits; Subcategory: [0121] Linear integrated circuits; Mounting: SMT
U6 = 541: usb c controller; LibraryVersion: V1; SnapEDA_Link: https://www.snapeda.com/parts/TCPP03-M20/STMicroelectronics/view-part/?ref=snap; Check_prices: https://www.snapeda.com/parts/TCPP03-M20/STMicroelectronics/view-part/?ref=eda; Unique ID: 541; Cost: 0; Category: [0100] Integrated circuits; Subcategory: [0115] Power Management; Mounting: SMT
U7 = 510: LibraryVersion: v1; Value: SR086; Footprint: *; Unique ID: 510; Category: [0100] Integrated circuits; Subcategory: [0103] Voltage Regulator - Switching; Mounting: SMT
U20 = 199: UA P/N: 15-0120; LibraryVersion: V1; Unique ID: 199; Value: 74HCT4052D; Cost: 0.123; Farnell: 1201328; Category: [0100] Integrated circuits; Subcategory: [0118] Decoders and Multiplexers; Mounting: SMT
U#1 = SP485EEN-L: 1/1 Transceiver Half RS422, RS485 8-SOIC; MF: Exar Corporation; SnapEDA_Link: https://www.snapeda.com/parts/SP485EEN-L/Exar%20Corporation/view-part/35751/?ref=snap; Availability: Unavailable; Value: *; Price: None; MP: SP485EEN-L; Package: SOIC-8 Exar
U#2 = VOT8024AB-VT: Optoisolator Triac Output 5300Vrms 1 Channel 4-SMD; MF: Vishay Semiconductor; Price: None; Package: SMD-4 Vishay Semiconductor; Value: *; MP: VOT8024AB-VT; Availability: Unavailable; SnapEDA_Link: https://www.snapeda.com/parts/VOT8024AB-VT/Vishay%20Semiconductor%20Opto%20Division/view-part/4219083/?ref=snap